# EAGLE design mega_shield_0_3 (EAGLE 6.5.0)
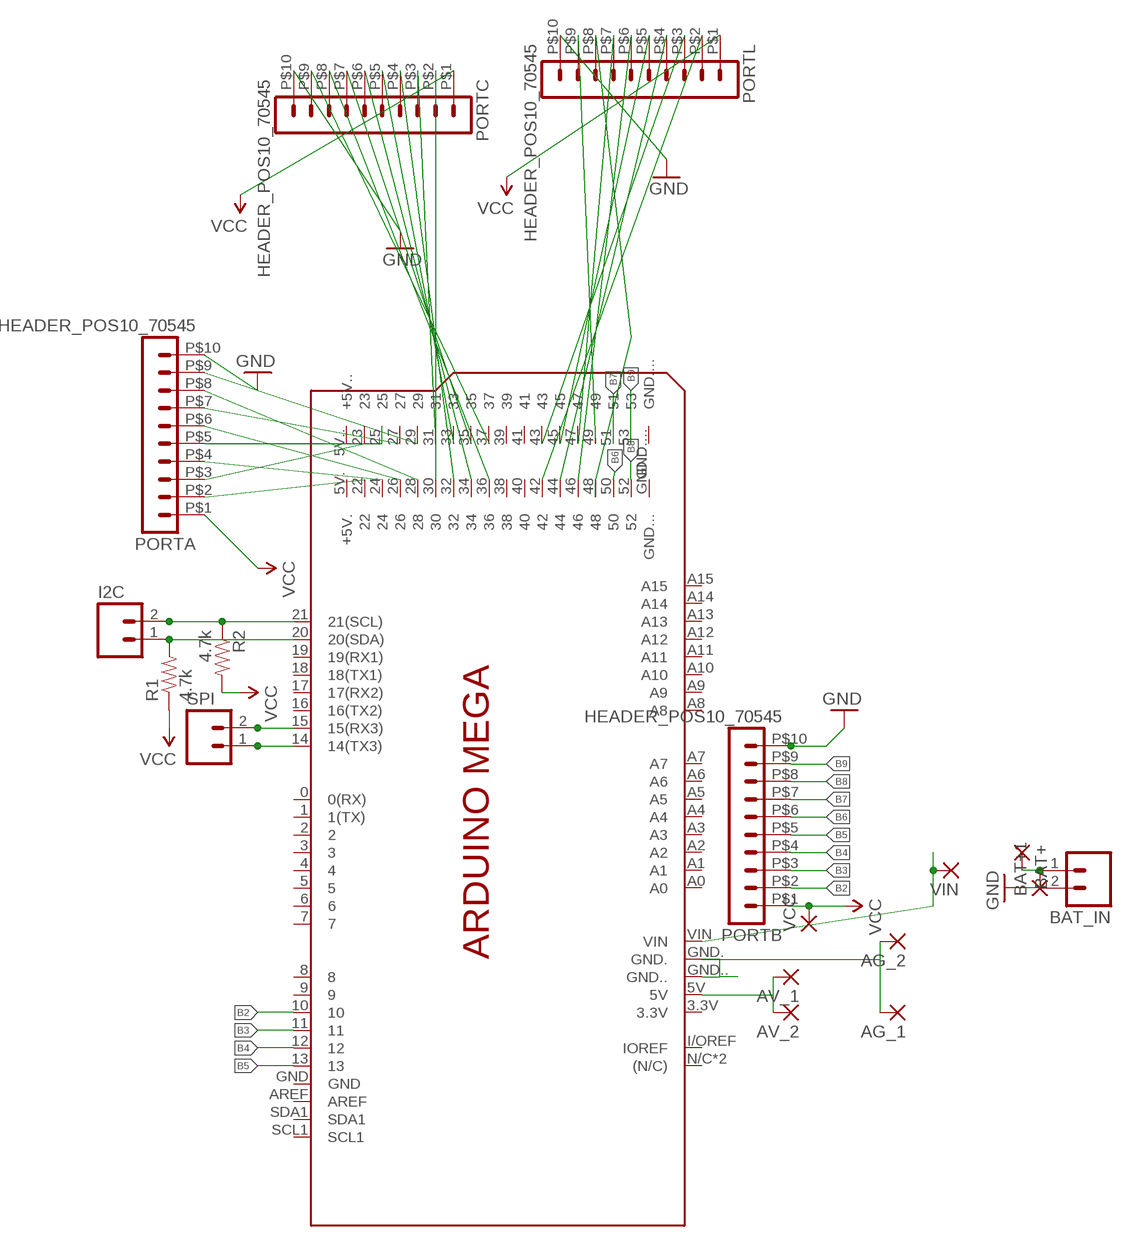
[diagram p0: schematic, sheet 1]

## Parts
AG_1  2,54/1,0  [2,54/1,0]
AG_2  2,54/1,0  [2,54/1,0]
AV_1  2,54/1,0  [2,54/1,0]
AV_2  2,54/1,0  [2,54/1,0]
BAT+  2,54/0,9  [2,54/0,9]
BAT+1  2,54/0,9  [2,54/0,9]
BAT_IN  M02PTH  [1X02]
I2C  M02PTH  [1X02]
PCB1  ARDUINO_MEGA  [ARDUINO_MEGA]
PORTA  HEADER_POS10_70545  [70545-POS10]
PORTB  HEADER_POS10_70545  [70545-POS10]
PORTC  HEADER_POS10_70545  [70545-POS10]
PORTL  HEADER_POS10_70545  [70545-POS10]
R1  4.7k  RESISTORPTH1  [AXIAL-0.3]
R2  4.7k  RESISTORPTH1  [AXIAL-0.3]
SPI  M02PTH  [1X02]
VCC  2,54/0,9  [2,54/0,9]
VIN  2,54/1,0  [2,54/1,0]

## Nets
B2: PCB1.10 PORTB.P$2
B3: PCB1.11 PORTB.P$3
B4: PCB1.12 PORTB.P$4
B5: PCB1.13 PORTB.P$5
B6: PCB1.50 PORTB.P$6
B7: PCB1.51 PORTB.P$7
B8: PCB1.52 PORTB.P$8
B9: PCB1.53 PORTB.P$9
GND: BAT_IN.2 PORTA.P$10 PORTB.P$10 PORTC.P$10 PORTL.P$10
GND_PI: AG_1.1(P) AG_2.1(P) PCB1.GND. PCB1.GND..
N$1: PCB1.22 PORTA.P$2
N$2: PCB1.23 PORTA.P$3
N$3: PCB1.24 PORTA.P$4
N$4: PCB1.25 PORTA.P$5
N$5: PCB1.26 PORTA.P$6
N$6: PCB1.27 PORTA.P$7
N$7: PCB1.28 PORTA.P$8
N$8: PCB1.29 PORTA.P$9
N$9: PCB1.14(14(TX3)) SPI.1
N$10: PCB1.15(15(RX3)) SPI.2
N$11: PCB1.30 PORTC.P$2
N$12: PCB1.31 PORTC.P$3
N$13: PCB1.32 PORTC.P$4
N$14: PCB1.33 PORTC.P$5
N$15: PCB1.34 PORTC.P$6
N$16: PCB1.35 PORTC.P$7
N$17: PCB1.36 PORTC.P$8
N$18: PCB1.37 PORTC.P$9
N$19: PCB1.42 PORTL.P$2
N$20: PCB1.43 PORTL.P$3
N$21: PCB1.44 PORTL.P$4
N$22: PCB1.45 PORTL.P$5
N$23: PCB1.46 PORTL.P$6
N$24: PCB1.47 PORTL.P$7
N$25: PCB1.49 PORTL.P$9
N$26: BAT+1.1(P) BAT+.1(P) BAT_IN.1
N$29: PCB1.48 PORTL.P$8
N$35: I2C.1 PCB1.20(20(SDA)) R1.P$2
N$36: I2C.2 PCB1.21(21(SCL)) R2.P$1
PI_VCC: AV_1.1(P) AV_2.1(P) PCB1.5V
VCC: PORTA.P$1 PORTB.P$1 PORTC.P$1 PORTL.P$1 R1.P$1 R2.P$2 VCC.1(P)
VIN: PCB1.VIN VIN.1(P)
Unconnected: PCB1.0(0(RX)) PCB1.1(1(TX)) PCB1.2 PCB1.3 PCB1.3.3V PCB1.4 PCB1.5 PCB1.5V.(+5V.) PCB1.5V..(+5V..) PCB1.6 PCB1.7 PCB1.8 PCB1.9 PCB1.16(16(TX2)) PCB1.17(17(RX2)) PCB1.18(18(TX1)) PCB1.19(19(RX1)) PCB1.38 PCB1.39 PCB1.40 PCB1.41 PCB1.A0 PCB1.A1 PCB1.A2 PCB1.A3 PCB1.A4 PCB1.A5 PCB1.A6 PCB1.A7 PCB1.A8 PCB1.A9 PCB1.A10 PCB1.A11 PCB1.A12 PCB1.A13 PCB1.A14 PCB1.A15 PCB1.AREF PCB1.GND PCB1.GND... PCB1.GND.... PCB1.I/OREF(IOREF) PCB1.N/C((N/C)) PCB1.RESET((N/C)) PCB1.SCL1 PCB1.SDA1

## Library data of the parts
AG_1 AG_2 AV_1 AV_2 VIN = wirepad:2,54/1,0: THROUGH-HOLE PAD
BAT+ BAT+1 VCC = wirepad:2,54/0,9: THROUGH-HOLE PAD
BAT_IN I2C SPI = SparkFun:M02: Header 2 Standard 2-pin 0.1" header. Use with straight break away headers (SKU : PRT-00116), right angle break away headers (PRT-00553), swiss pins (PRT-00743), machine pins (PRT-00117), and female headers (PRT-00115). Molex polarized connector foot print use with SKU : PRT-08233 with associated crimp pins and housings.
PCB1 = Nathans_Arduinos:ARDUINO_MEGA: Device for representing an Arduino Mega board with a footprint in an EAGLE design. Created by Dave Young for Element14. More EAGLE documentation at: http://www.element14.com/community/community/knode/cadsoft_eagle
PORTA PORTB PORTC PORTL = con-molex-c-grid-sl:HEADER_POS10_?: Molex -C-Grid® / SL Series connector Wire-to-Board 2.54 mm (0.100") pitch header, 10 positions.
R1 R2 = SparkFun:RESISTOR: Resistor Basic schematic elements and footprints for 0603, 1206, and PTH 1/10th watt (small) resistors.

## Net classes
0 default: width 0.203 mm, drill 0.254 mm, clearance 0.178 mm
1 VCC: width 0.381 mm, drill 0.305 mm, clearance 0.305 mm

## Board
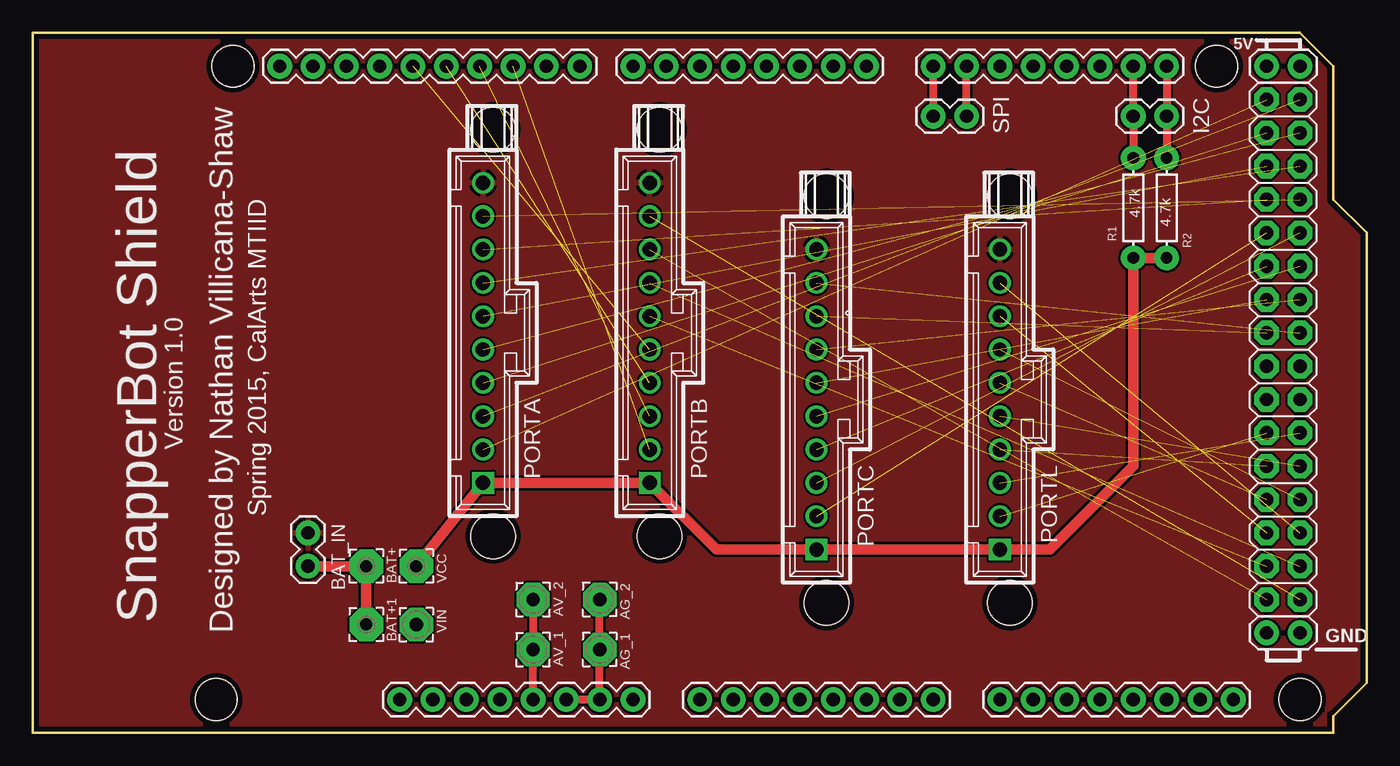
[diagram p1: board, top side]
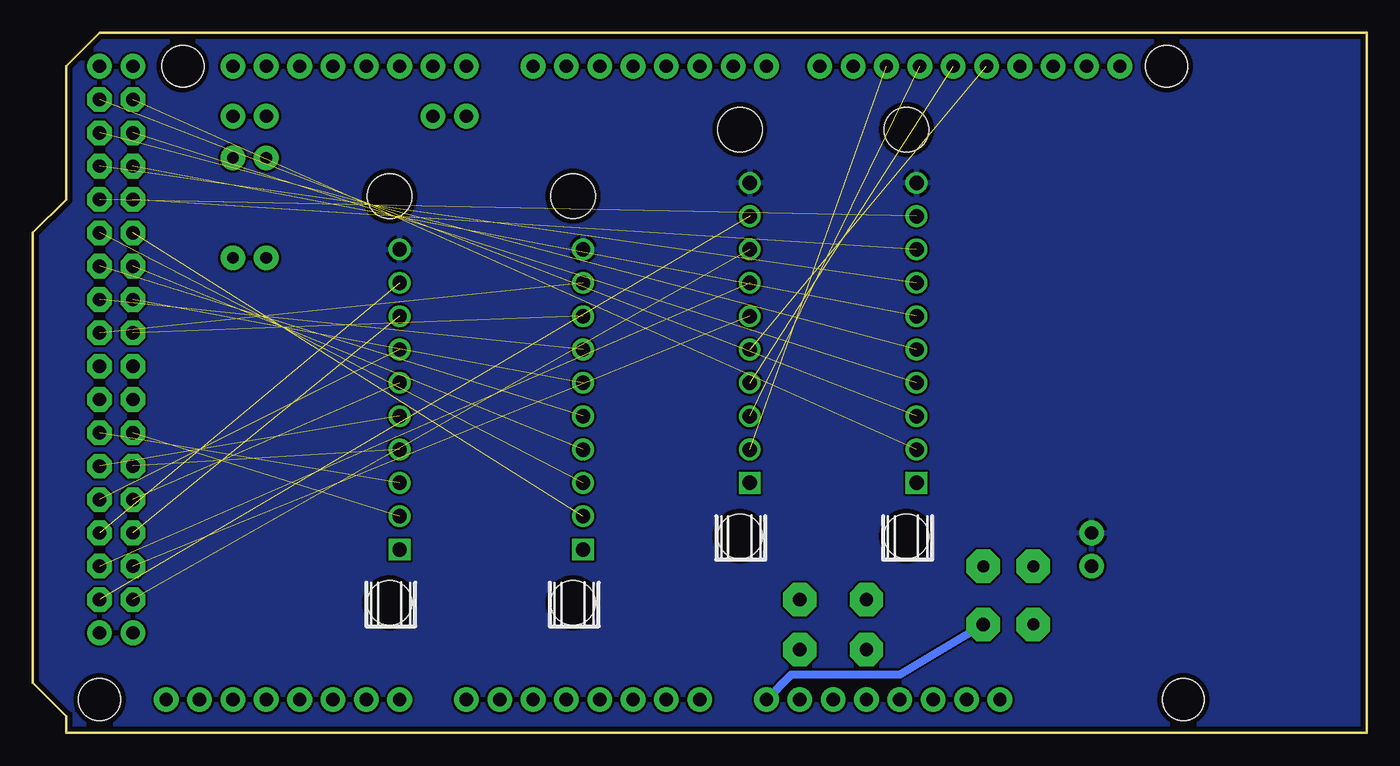
[diagram p2: board, bottom side, seen from below]

Size 101.6 x 53.34 mm. Coordinates in mm from the lower left corner, seen from the top.
Outline: 0,0 99.06,0 99.06,1.27 101.6,3.81 101.6,38.1 99.06,40.64 99.06,50.8 96.52,53.34 0,53.34 0,0
Copper layers (1*16): Top 0.0356mm / dielectric 1.5011mm / Bottom 0.0356mm
Design rules "oshPark": minimum track width 6mil, minimum drill 13mil, track to track 6mil, track to pad 6mil, pad to pad 6mil, via to via 6mil, smd to smd 6mil, copper to edge 15mil, drill to drill 6mil, minimum pad ring 7mil, minimum via ring 7mil, stop-mask expansion 3mil, vias tented up to drill 0mil, thermal gap 10mil

### Footprints (pad centres in the part's own frame; a part is rotated, then mirrored left to right if it is on the bottom)
2,54/1,0 = drill 1.016 pad 2.54 octagon: 1 0,0
2,54/0,9 = drill 0.914 pad 2.54 octagon: 1 0,0
1X02 = drill 1.016 pad 1.88: 1 0,0; 2 2.54,0
ARDUINO_MEGA = drill 1.016 pad 1.88: 0 63.5,50.8; 1 60.96,50.8; 2 58.42,50.8; 3 55.88,50.8; 3.3V 35.56,2.54; 4 53.34,50.8; 5 50.8,50.8; 5V 38.1,2.54; 5V. 93.98,50.8; 5V.. 96.52,50.8; 6 48.26,50.8; 7 45.72,50.8; 8 41.656,50.8; 9 39.116,50.8; 10 36.576,50.8; 11 34.036,50.8; 12 31.496,50.8; 13 28.956,50.8; 14 68.58,50.8; 15 71.12,50.8; 16 73.66,50.8; 17 76.2,50.8; 18 78.74,50.8; 19 81.28,50.8; 20 83.82,50.8; 21 86.36,50.8; A0 50.8,2.54; A1 53.34,2.54; A2 55.88,2.54; A3 58.42,2.54; A4 60.96,2.54; A5 63.5,2.54; A6 66.04,2.54; A7 68.58,2.54; A8 73.66,2.54; A9 76.2,2.54; A10 78.74,2.54; A11 81.28,2.54; A12 83.82,2.54; A13 86.36,2.54; A14 88.9,2.54; A15 91.44,2.54; AREF 23.876,50.8; GND 26.416,50.8; GND. 43.18,2.54; GND.. 40.64,2.54; GND... 93.98,7.62; GND.... 96.52,7.62; I/OREF 30.48,2.54; N/C 27.94,2.54; RESET 33.02,2.54; SCL1 18.796,50.8; SDA1 21.336,50.8; VIN 45.72,2.54 | drill 1.016 pad 1.88 octagon: 22 93.98,48.26; 23 96.52,48.26; 24 93.98,45.72; 25 96.52,45.72; 26 93.98,43.18; 27 96.52,43.18; 28 93.98,40.64; 29 96.52,40.64; 30 93.98,38.1; 31 96.52,38.1; 32 93.98,35.56; 33 96.52,35.56; 34 93.98,33.02; 35 96.52,33.02; 36 93.98,30.48; 37 96.52,30.48; 38 93.98,27.94; 39 96.52,27.94; 40 93.98,25.4; 41 96.52,25.4; 42 93.98,22.86; 43 96.52,22.86; 44 93.98,20.32; 45 96.52,20.32; 46 93.98,17.78; 47 96.52,17.78; 48 93.98,15.24; 49 96.52,15.24; 50 93.98,12.7; 51 96.52,12.7; 52 93.98,10.16; 53 96.52,10.16 | hole 3.2: 15.24,50.8; 13.97,2.54; 90.17,50.8; 96.52,2.54
70545-POS10 = drill 1.1 square: P$1 11.43,0 | drill 1.1: P$2 8.89,0; P$3 6.35,0; P$4 3.81,0; P$5 1.27,0; P$6 -1.27,0; P$7 -3.81,0; P$8 -6.35,0; P$9 -8.89,0; P$10 -11.43,0 | hole 3.404: -15.494,0.762; 15.494,0.762
AXIAL-0.3 = drill 0.9 pad 1.88: P$1 -3.81,0; P$2 3.81,0

### Placement (x,y rotation side)
AG_1  43.18,6.35 180 top
AG_2  43.18,10.16 180 top
AV_1  38.1,6.35 0 top
AV_2  38.1,10.16 0 top
BAT+  25.4,12.7 0 top
BAT+1  25.4,8.26 0 top
BAT_IN  20.95,12.7 90 top
I2C  83.82,46.99 0 top
PCB1  0,0 0 top
PORTA  34.29,30.48 270 top
PORTB  46.99,30.48 270 top
PORTC  59.69,25.4 270 top
PORTL  73.66,25.4 270 top
R1  83.82,40.01 90 top
R2  86.36,40.01 270 top
SPI  68.58,46.99 0 top
VCC  29.21,12.7 0 top
VIN  29.21,8.26 0 top

### Tracks (layer width: path | path; a pad name or v marks a point on that pad's centre or on a via)
B2  (1 unrouted)
B3  (1 unrouted)
B4  (1 unrouted)
B5  (1 unrouted)
B6  (1 unrouted)
B7  (1 unrouted)
B8  (1 unrouted)
B9  (1 unrouted)
GND
  pour Top: 0,0 0,53.34 96.52,53.34 99.06,50.8 99.06,40.64 101.6,38.1 101.6,3.81 99.06,1.27 99.06,0
  pour Bottom: 0,53.34 96.52,53.34 99.06,50.8 99.06,40.64 101.6,38.1 101.6,3.81 99.06,1.27 99.06,0 0,0
GND_PI
  Top 0.61: PCB1.GND.. PCB1.GND. AG_1.1 AG_2.1
N$1  (1 unrouted)
N$2  (1 unrouted)
N$3  (1 unrouted)
N$4  (1 unrouted)
N$5  (1 unrouted)
N$6  (1 unrouted)
N$7  (1 unrouted)
N$8  (1 unrouted)
N$9
  Top 0.61: SPI.1 PCB1.14
N$10
  Top 0.61: SPI.2 PCB1.15
N$11  (1 unrouted)
N$12  (1 unrouted)
N$13  (1 unrouted)
N$14  (1 unrouted)
N$15  (1 unrouted)
N$16  (1 unrouted)
N$17  (1 unrouted)
N$18  (1 unrouted)
N$19  (1 unrouted)
N$20  (1 unrouted)
N$21  (1 unrouted)
N$22  (1 unrouted)
N$23  (1 unrouted)
N$24  (1 unrouted)
N$25  (1 unrouted)
N$26
  Top 0.813: BAT_IN.1 BAT+.1 BAT+1.1
N$29  (1 unrouted)
N$35
  Top 0.61: PCB1.20 I2C.1 R1.P$2
N$36
  Top 0.61: PCB1.21 I2C.2 R2.P$1
PI_VCC
  Top 0.61: PCB1.5V AV_1.1 AV_2.1
VCC
  Top 0.813: 83.82,35.56 83.82,20.32 77.47,13.97 PORTL.P$1 PORTC.P$1 52.07,13.97 PORTB.P$1 PORTA.P$1 VCC.1 | 83.82,35.56 R1.P$1 | R2.P$2 84.45,36.2 83.82,35.56
VIN
  Bottom 0.61: PCB1.VIN 43.81,4.45 35.56,4.45 VIN.1

### Text on the board
_tsilk: SnapperBot Shield | Version 1.0 | Spring 2015, CalArts MTIID | Designed by Nathan Villicana-Shaw